# Altium schematic sheet STM32F1_CNC_SCH.SchDoc
size A4
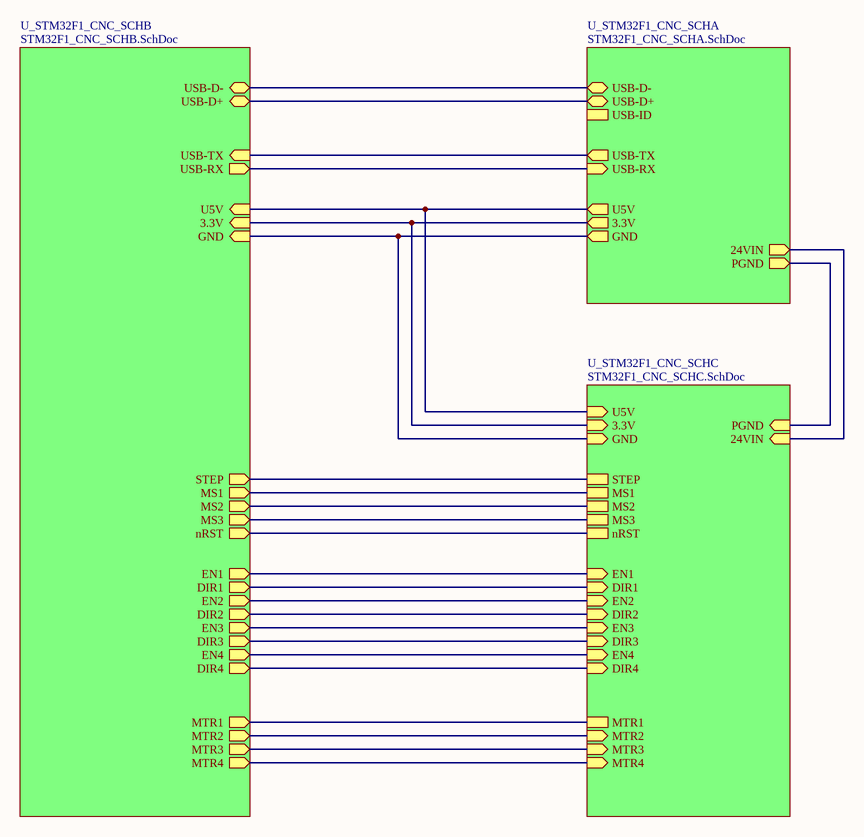
[diagram p0: STM32F1_CNC_SCH.SchDoc]

## Sub-sheets
U_STM32F1_CNC_SCHA = STM32F1_CNC_SCHA.SchDoc: 24VIN (out), PGND (out), U5V (out), GND (out), USB-D- (bidir), USB-D+ (bidir), USB-ID, USB-TX (out), USB-RX (in), 3.3V (out)
U_STM32F1_CNC_SCHB = STM32F1_CNC_SCHB.SchDoc: GND (in), USB-D- (bidir), USB-D+ (bidir), USB-TX (in), USB-RX (out), 3.3V (in), U5V (in), STEP (out), MS1 (out), MS2 (out), MS3 (out), nRST (out), EN1 (out), DIR1 (out), EN2 (out), DIR2 (out), EN3 (out), DIR3 (out), EN4 (out), DIR4 (out), MTR1 (out), MTR2 (out), MTR3 (out), MTR4 (out)
U_STM32F1_CNC_SCHC = STM32F1_CNC_SCHC.SchDoc: 24VIN (in), PGND (in), U5V (in), GND (in), 3.3V (in), STEP, MS1, MS2, MS3, nRST, EN1 (in), DIR1 (in), EN2 (in), DIR2 (in), EN3 (in), DIR3 (in), EN4 (in), DIR4 (in), MTR1, MTR2 (in), MTR3 (in), MTR4 (in)

## Nets
(unnamed): sheet U_STM32F1_CNC_SCHA/24VIN, sheet U_STM32F1_CNC_SCHC/24VIN
(unnamed): sheet U_STM32F1_CNC_SCHA/PGND, sheet U_STM32F1_CNC_SCHC/PGND
(unnamed): sheet U_STM32F1_CNC_SCHA/U5V, sheet U_STM32F1_CNC_SCHB/U5V, sheet U_STM32F1_CNC_SCHC/U5V
(unnamed): sheet U_STM32F1_CNC_SCHA/GND, sheet U_STM32F1_CNC_SCHB/GND, sheet U_STM32F1_CNC_SCHC/GND
(unnamed): sheet U_STM32F1_CNC_SCHA/USB-D-, sheet U_STM32F1_CNC_SCHB/USB-D-
(unnamed): sheet U_STM32F1_CNC_SCHA/USB-D+, sheet U_STM32F1_CNC_SCHB/USB-D+
(unnamed): sheet U_STM32F1_CNC_SCHA/USB-TX, sheet U_STM32F1_CNC_SCHB/USB-TX
(unnamed): sheet U_STM32F1_CNC_SCHA/USB-RX, sheet U_STM32F1_CNC_SCHB/USB-RX
(unnamed): sheet U_STM32F1_CNC_SCHA/3.3V, sheet U_STM32F1_CNC_SCHB/3.3V, sheet U_STM32F1_CNC_SCHC/3.3V
(unnamed): sheet U_STM32F1_CNC_SCHB/STEP, sheet U_STM32F1_CNC_SCHC/STEP
(unnamed): sheet U_STM32F1_CNC_SCHB/MS1, sheet U_STM32F1_CNC_SCHC/MS1
(unnamed): sheet U_STM32F1_CNC_SCHB/MS2, sheet U_STM32F1_CNC_SCHC/MS2
(unnamed): sheet U_STM32F1_CNC_SCHB/MS3, sheet U_STM32F1_CNC_SCHC/MS3
(unnamed): sheet U_STM32F1_CNC_SCHB/nRST, sheet U_STM32F1_CNC_SCHC/nRST
(unnamed): sheet U_STM32F1_CNC_SCHB/EN1, sheet U_STM32F1_CNC_SCHC/EN1
(unnamed): sheet U_STM32F1_CNC_SCHB/DIR1, sheet U_STM32F1_CNC_SCHC/DIR1
(unnamed): sheet U_STM32F1_CNC_SCHB/EN2, sheet U_STM32F1_CNC_SCHC/EN2
(unnamed): sheet U_STM32F1_CNC_SCHB/DIR2, sheet U_STM32F1_CNC_SCHC/DIR2
(unnamed): sheet U_STM32F1_CNC_SCHB/EN3, sheet U_STM32F1_CNC_SCHC/EN3
(unnamed): sheet U_STM32F1_CNC_SCHB/DIR3, sheet U_STM32F1_CNC_SCHC/DIR3
(unnamed): sheet U_STM32F1_CNC_SCHB/EN4, sheet U_STM32F1_CNC_SCHC/EN4
(unnamed): sheet U_STM32F1_CNC_SCHB/DIR4, sheet U_STM32F1_CNC_SCHC/DIR4
(unnamed): sheet U_STM32F1_CNC_SCHB/MTR1, sheet U_STM32F1_CNC_SCHC/MTR1
(unnamed): sheet U_STM32F1_CNC_SCHB/MTR2, sheet U_STM32F1_CNC_SCHC/MTR2
(unnamed): sheet U_STM32F1_CNC_SCHB/MTR3, sheet U_STM32F1_CNC_SCHC/MTR3
(unnamed): sheet U_STM32F1_CNC_SCHB/MTR4, sheet U_STM32F1_CNC_SCHC/MTR4